# EAGLE design PracticalDMX (EAGLE 9.0.1)
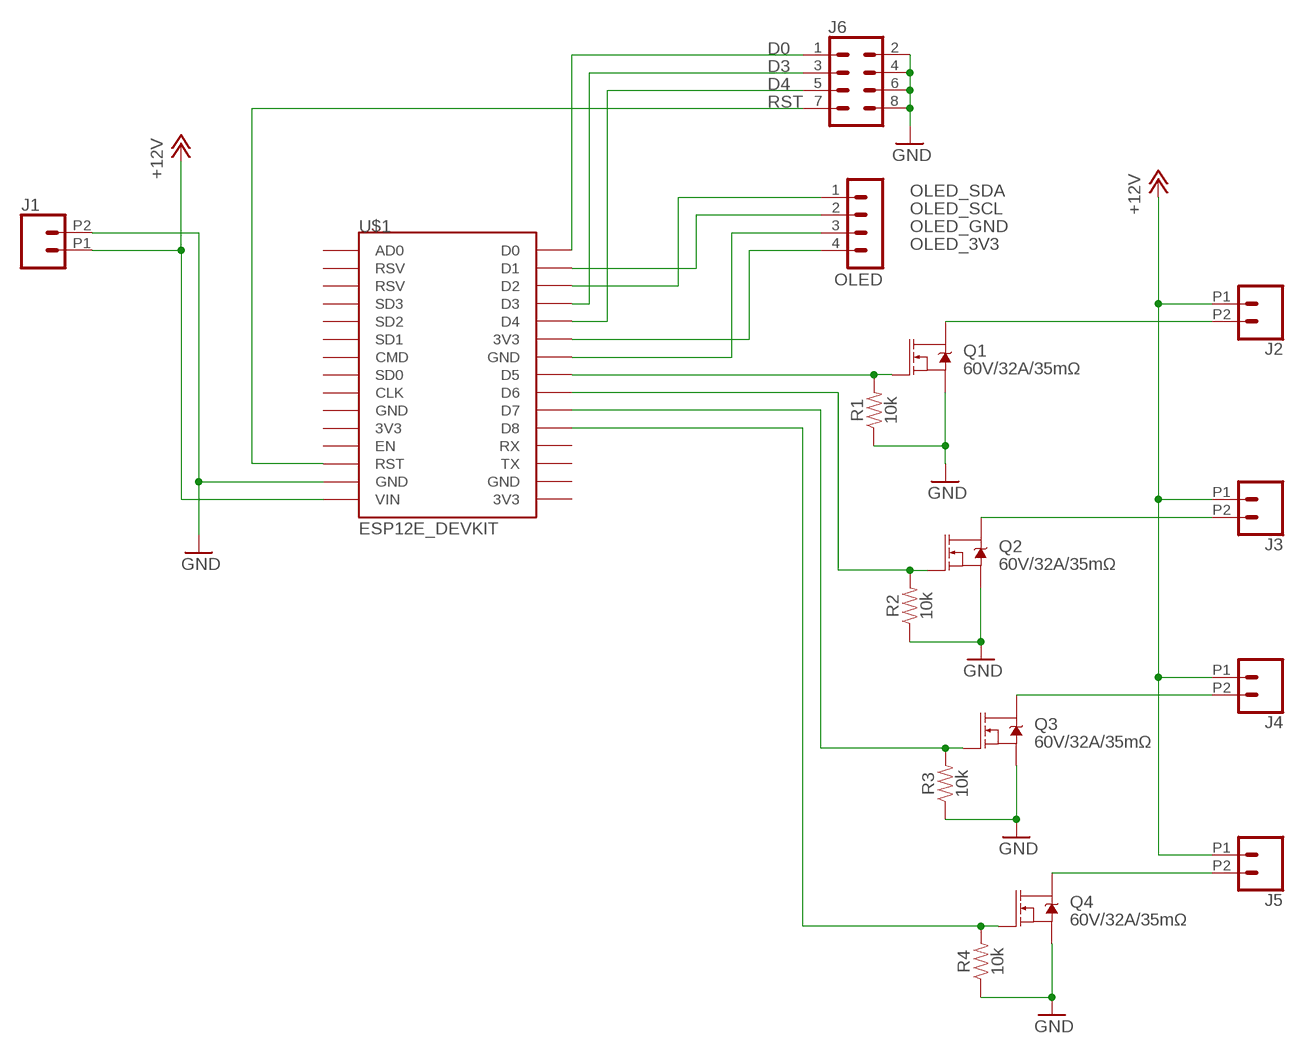
[diagram p0: schematic, sheet 1]

## Parts
J1  CONN_022.54MM_SCREWTERM  [1X02_2.54_SCREWTERM]
J2  CONN_022.54MM_SCREWTERM  [1X02_2.54_SCREWTERM]
J3  CONN_022.54MM_SCREWTERM  [1X02_2.54_SCREWTERM]
J4  CONN_022.54MM_SCREWTERM  [1X02_2.54_SCREWTERM]
J5  CONN_022.54MM_SCREWTERM  [1X02_2.54_SCREWTERM]
J6  CONN_04X2  [2X4]
OLED  MA04-1  [MA04-1]
Q1  60V/32A/35mΩ  MOSFET-NCH-FQP30N06L  [TO220V]
Q2  60V/32A/35mΩ  MOSFET-NCH-FQP30N06L  [TO220V]
Q3  60V/32A/35mΩ  MOSFET-NCH-FQP30N06L  [TO220V]
Q4  60V/32A/35mΩ  MOSFET-NCH-FQP30N06L  [TO220V]
R1  10k  10KOHM-HORIZ-1/4W-5%  [AXIAL-0.3]
R2  10k  10KOHM-HORIZ-1/4W-5%  [AXIAL-0.3]
R3  10k  10KOHM-HORIZ-1/4W-5%  [AXIAL-0.3]
R4  10k  10KOHM-HORIZ-1/4W-5%  [AXIAL-0.3]
U$1  ESP12E_DEVKIT  [ESP12E_DEVKIT]

## Nets
+12V: J1.P1 J2.P1 J3.P1 J4.P1 J5.P1 U$1.VIN
D0: J6.1 U$1.D0
D3: J6.3 U$1.D3
D4: J6.5 U$1.D4
GND: J1.P2 J6.2 J6.4 J6.6 J6.8 Q1.3(S) Q2.3(S) Q3.3(S) Q4.3(S) R1.P$1 R2.P$1 R3.P$1 R4.P$1 U$1.GND@1(GND)
N$1: J5.P2 Q4.2(D)
N$2: J4.P2 Q3.2(D)
N$7: Q1.1(G) R1.P$2 U$1.D5
N$8: Q2.1(G) R2.P$2 U$1.D6
N$9: Q3.1(G) R3.P$2 U$1.D7
N$10: Q4.1(G) R4.P$2 U$1.D8
N$11: J3.P2 Q2.2(D)
N$12: J2.P2 Q1.2(D)
OLED_3V3: OLED.4 U$1.3V3@1(3V3)
OLED_GND: OLED.3 U$1.GND@2(GND)
OLED_SCL: OLED.2 U$1.D1
OLED_SDA: OLED.1 U$1.D2
RST: J6.7 U$1.RST
Unconnected: U$1.3V3@0(3V3) U$1.3V3@2(3V3) U$1.AD0 U$1.CLK U$1.CMD U$1.EN U$1.GND@0(GND) U$1.GND@3(GND) U$1.RSV@0(RSV) U$1.RSV@1(RSV) U$1.RX U$1.SD0 U$1.SD1 U$1.SD2 U$1.SD3 U$1.TX

## Library data of the parts
J1-J5 = SparkFun-Connectors:CONN_02: Multi connection point. Often used as Generic Header-pin footprint for 0.1 inch spaced/style header connections On any of the 0.1 inch spaced packages, you can populate with these: Break Away Headers - Straight <https://www.sparkfun.com/products/116> (PRT-00116) Break Away Male Headers - Right Angle <https://www.sparkfun.com/products/553> (PRT-00553) Female Headers <https://www.sparkfun.com/products/115> (PRT-00115) Break Away Headers - Machine Pin <https://www.sparkfun.com/products/117> (PRT-00117) Break Away Female Headers - Swiss Machine Pin <https://www.sparkfun.com/products/743> (PRT-00743) For SCREWTERMINALS and SPRING TERMINALS visit here: Screw Terimnals on SparkFun.com <https://www.sparkfun.com/search/results?term=Screw+Terminals> (5mm/3.5mm/2.54mm spacing) This device is also useful as a general connection point to wire up your design to another part of your project. Our various solder wires solder well into these plated through hole pads. Hook-Up Wire - Assortment (Stranded, 22 AWG) <https://www.sparkfun.com/products/11375> (PRT-11375) Hook-Up Wire - Assortment (Solid Core, 22 AWG) <https://www.sparkfun.com/products/11367> (PRT-11367) View the entire wire category on our website here <https://www.sparkfun.com/categories/141> Special notes: Molex polarized connector foot print use with: PRT-08233 with associated crimp pins and housings. 2.54_SCREWTERM for use with PRT-10571. 3.5mm Screw Terminal footprints for PRT-08084 5mm Screw Terminal footprints for use with PRT-08432
J6 = SparkFun-Connectors:CONN_04X2: Multi connection point. Often used as Generic Header-pin footprint for 0.1 inch spaced/style header connections On any of the 0.1 inch spaced packages, you can populate with these: Break Away Headers - Straight <https://www.sparkfun.com/products/116> (PRT-00116) Break Away Male Headers - Right Angle <https://www.sparkfun.com/products/553> (PRT-00553) Female Headers <https://www.sparkfun.com/products/115> (PRT-00115) Break Away Headers - Machine Pin <https://www.sparkfun.com/products/117> (PRT-00117) Break Away Female Headers - Swiss Machine Pin <https://www.sparkfun.com/products/743> (PRT-00743)
OLED = con-lstb:MA04-1: PIN HEADER; OC_FARNELL: unknown; OC_NEWARK: unknown
Q1-Q4 = SparkFun-DiscreteSemi:MOSFET-NCH: N-channel MOSFETs Voltage controlled devices that allow control of high current outputs. SparkFun Products: SparkFun OpenScale <https://www.sparkfun.com/products/13261> SparkFun Digital Sandbox <https://www.sparkfun.com/products/12651> SparkFun Monster Moto Shield <https://www.sparkfun.com/products/10182> SparkFun MOSFET Power Controller <https://www.sparkfun.com/products/11214>; PROD_ID: TRANS-10060
R1-R4 = SparkFun-Resistors:10KOHM: 10kΩ resistor A resistor is a passive two-terminal electrical component that implements electrical resistance as a circuit element. Resistors act to reduce current flow, and, at the same time, act to lower voltage levels within circuits. - Wikipedia; PROD_ID: RES-09435
U$1 = ESP12E_DEVKIT:ESP12E_DEVKIT: ESP12E DEVKIT BOARD

## Board
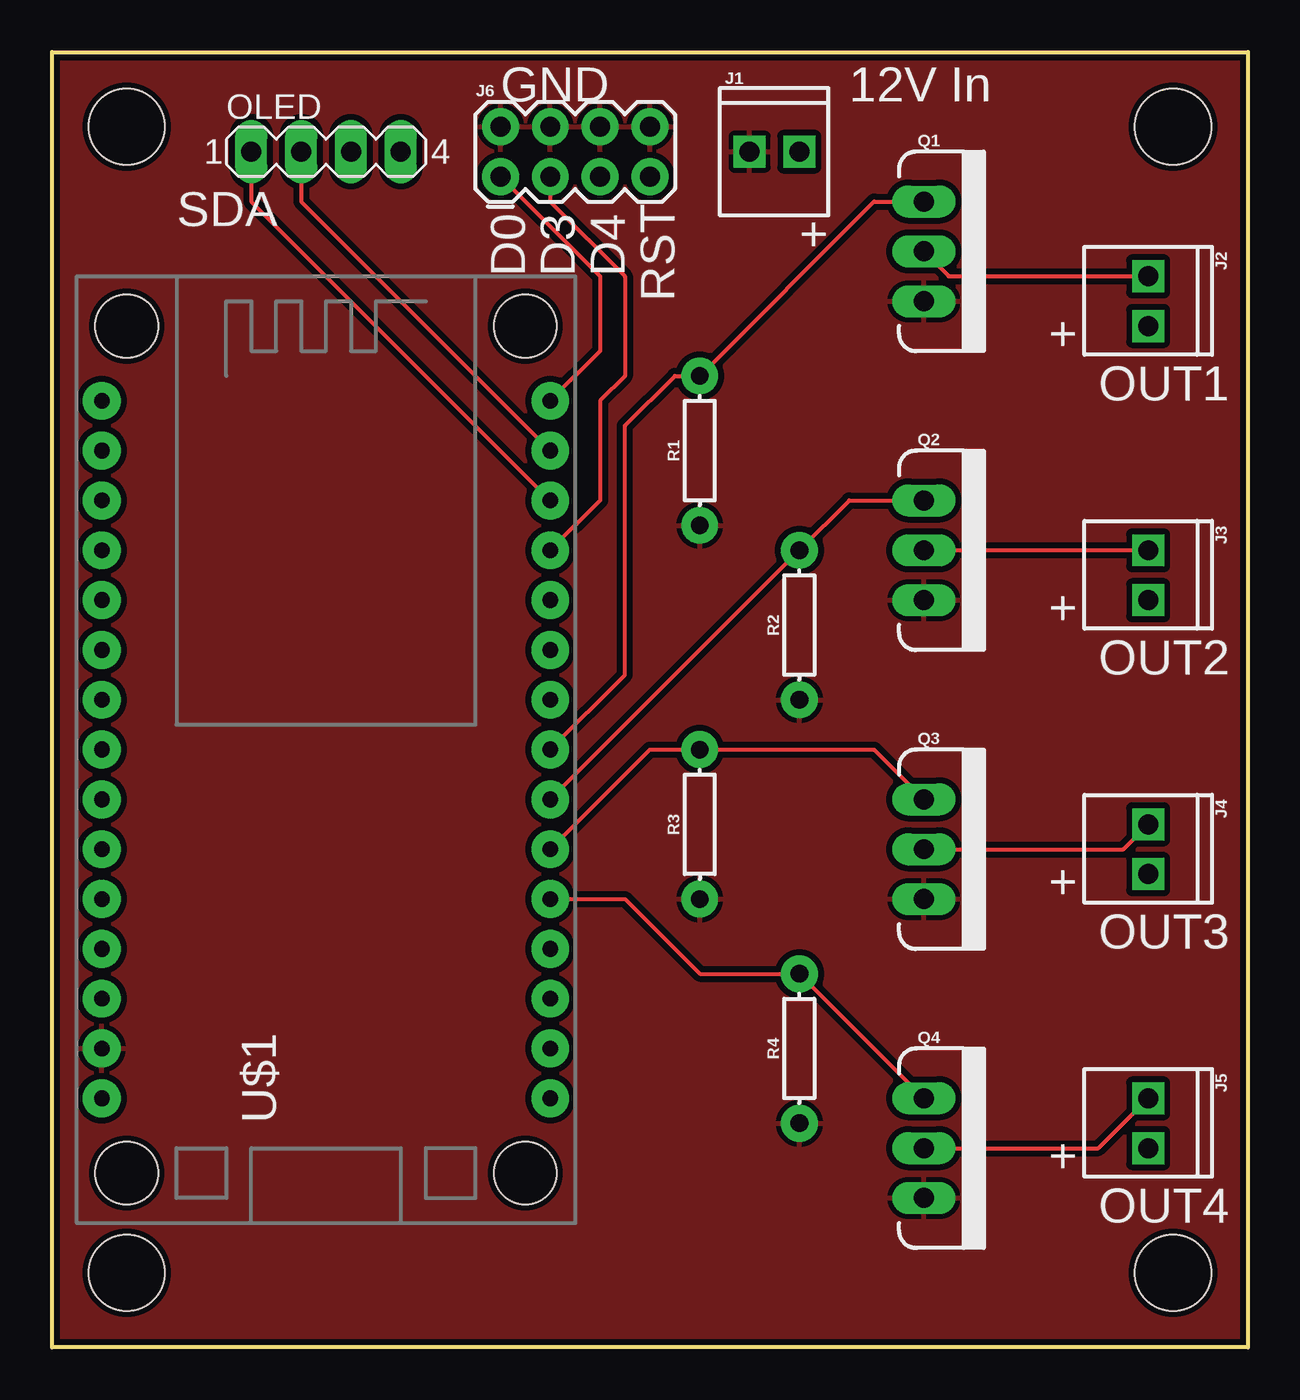
[diagram p1: board, top side]
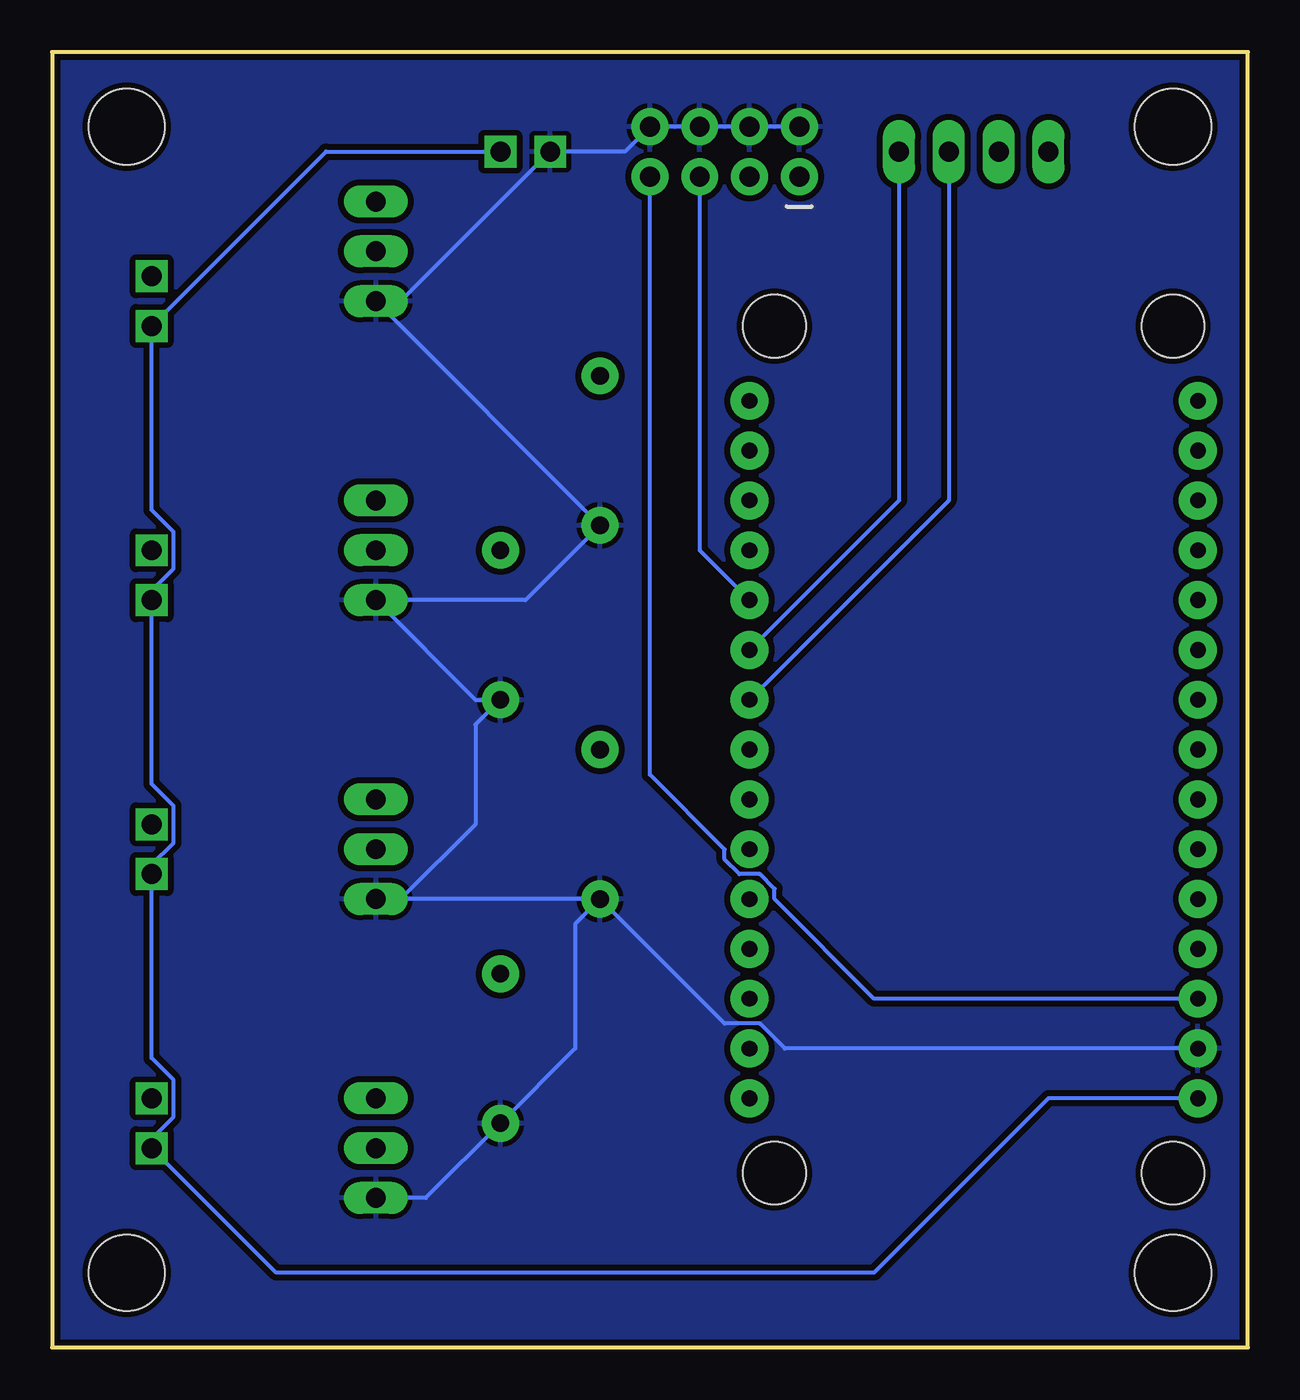
[diagram p2: board, bottom side, seen from below]

Size 60.96 x 66.04 mm. Coordinates in mm from the lower left corner, seen from the top.
Outline: 0,0 0,66.04 60.96,66.04 60.96,0 0,0
Copper layers (1*16): Top 0.035mm / dielectric 1.5mm / Bottom 0.035mm
Design rules "SparkFun": minimum track width 8mil, minimum drill 20mil, track to track 8mil, track to pad 8mil, pad to pad 8mil, via to via 8mil, smd to smd 8mil, copper to edge 8mil, drill to drill 8mil, minimum pad ring 12mil, minimum via ring 10mil, stop-mask expansion 4mil, vias tented up to drill 20mil, thermal gap 10mil
Holes 3.89 mm at 3.81,3.81 57.15,3.81 57.15,62.23 3.81,62.23

### Footprints (pad centres in the part's own frame; a part is rotated, then mirrored left to right if it is on the bottom)
1X02_2.54_SCREWTERM = drill 1.016 square: P1 2.54,0; P2 0,0
2X4 = drill 1.016 pad 1.88: 1 -3.81,-1.27; 2 -3.81,1.27; 3 -1.27,-1.27; 4 -1.27,1.27; 5 1.27,-1.27; 6 1.27,1.27; 7 3.81,-1.27; 8 3.81,1.27
MA04-1 = drill 1.016 long: 1 -3.81,0; 2 -1.27,0; 3 1.27,0; 4 3.81,0
TO220V = drill 1.016 long: 1 -2.54,0; 2 0,0; 3 2.54,0
AXIAL-0.3 = drill 0.9 pad 1.88: P$1 -3.81,0; P$2 3.81,0
ESP12E_DEVKIT = drill 0.8 pad 1.93: 3V3@0 -11.43,-7.62; 3V3@1 11.43,5.08; 3V3@2 11.43,-17.78; AD0 -11.43,17.78; CLK -11.43,-2.54; CMD -11.43,2.54; D0 11.43,17.78; D1 11.43,15.24; D2 11.43,12.7; D3 11.43,10.16; D4 11.43,7.62; D5 11.43,0; D6 11.43,-2.54; D7 11.43,-5.08; D8 11.43,-7.62; EN -11.43,-10.16; GND@0 -11.43,-5.08; GND@1 -11.43,-15.24; GND@2 11.43,2.54; GND@3 11.43,-15.24; RST -11.43,-12.7; RSV@0 -11.43,15.24; RSV@1 -11.43,12.7; RX 11.43,-10.16; SD0 -11.43,0; SD1 -11.43,5.08; SD2 -11.43,7.62; SD3 -11.43,10.16; TX 11.43,-12.7; VIN -11.43,-17.78 | hole 3.2: -10.16,21.59; 10.16,21.59; 10.16,-21.59; -10.16,-21.59

### Placement (x,y rotation side)
J1  35.56,60.96 0 top
J2  55.88,54.61 270 top
J3  55.88,40.64 270 top
J4  55.88,26.67 270 top
J5  55.88,12.7 270 top
J6  26.67,60.96 0 top
OLED  13.97,60.96 0 top
Q1  44.45,55.88 270 top
Q2  44.45,40.64 270 top
Q3  44.45,25.4 270 top
Q4  44.45,10.16 270 top
R1  33.02,45.72 90 top
R2  38.1,36.83 90 top
R3  33.02,26.67 90 top
R4  38.1,15.24 90 top
U$1  13.97,30.48 0 top

### Tracks (layer width: path | path; a pad name or v marks a point on that pad's centre or on a via)
+12V
  Bottom 0.203: U$1.VIN 10.16,12.7 19.05,3.81 49.53,3.81 J5.P1 55.88,10.64 54.76,11.76 54.76,13.64 55.88,14.76 J4.P1 55.88,24.61 54.76,25.73 54.76,27.61 55.88,28.73 J3.P1 55.88,38.58 54.76,39.7 54.76,41.58 55.88,42.7 J2.P1 46.99,60.96 J1.P1
D0
  Top 0.203: J6.1 27.94,54.61 27.94,50.8 U$1.D0
D3
  Top 0.203: J6.3 25.4,58.42 29.21,54.61 29.21,49.53 27.94,48.26 27.94,43.18 U$1.D3
D4
  Bottom 0.203: J6.5 27.94,40.64 U$1.D4
GND
  Bottom 0.203: U$1.GND@1 23.6,15.24 24.87,16.51 26.67,16.51 R3.P$1 | R3.P$1 34.29,21.59 34.29,15.24 R4.P$1 41.91,7.62 Q4.3 | R3.P$1 Q3.3 43.18,22.86 39.37,26.67 39.37,31.75 R2.P$1 39.37,33.02 Q2.3 36.83,38.1 R1.P$1 Q1.3 43.18,53.34 J1.P2 31.75,60.96 J6.8 J6.6 J6.4 J6.2
  pour Top (isolate 0.305): 0,66.04 60.96,66.04 60.96,0 0,0
  pour Bottom (isolate 0.305): 0,66.04 60.96,66.04 60.96,0 0,0
N$1
  Top 0.203: Q4.2 53.34,10.16 J5.P2
N$2
  Top 0.203: Q3.2 54.61,25.4 J4.P2
N$7
  Top 0.203: U$1.D5 29.21,34.29 29.21,46.99 31.75,49.53 R1.P$2 41.91,58.42 Q1.1
N$8
  Top 0.203: U$1.D6 R2.P$2 40.64,43.18 Q2.1
N$9
  Top 0.203: U$1.D7 30.48,30.48 R3.P$2 41.91,30.48 Q3.1
N$10
  Top 0.203: U$1.D8 29.21,22.86 33.02,19.05 R4.P$2 Q4.1
N$11
  Top 0.203: Q2.2 J3.P2
N$12
  Top 0.203: Q1.2 45.72,54.61 J2.P2
N$13
  Top 0.152: 0,0 0,66.04 60.96,66.04 60.96,0 0,0
OLED_3V3
  Bottom 0.203: OLED.4 17.78,43.18 U$1.3V3@1
OLED_GND
  Bottom 0.203: OLED.3 15.24,43.18 U$1.GND@2
OLED_SCL
  Top 0.203: OLED.2 12.7,58.42 U$1.D1
OLED_SDA
  Top 0.203: OLED.1 10.16,58.42 U$1.D2
RST
  Bottom 0.203: U$1.RST 19.05,17.78 24.13,22.86 24.13,23.39 24.87,24.13 25.93,24.13 26.67,24.87 26.67,25.4 30.48,29.21 J6.7

### Text on the board
tPlace: GND | 12V In | SDA | + | D0 | D3 | D4 | RST | + | OUT1 | + | OUT2 | + | OUT3 | + | OUT4